# EAGLE design PHOTODIODE SENSOR (EAGLE 9.6.2)
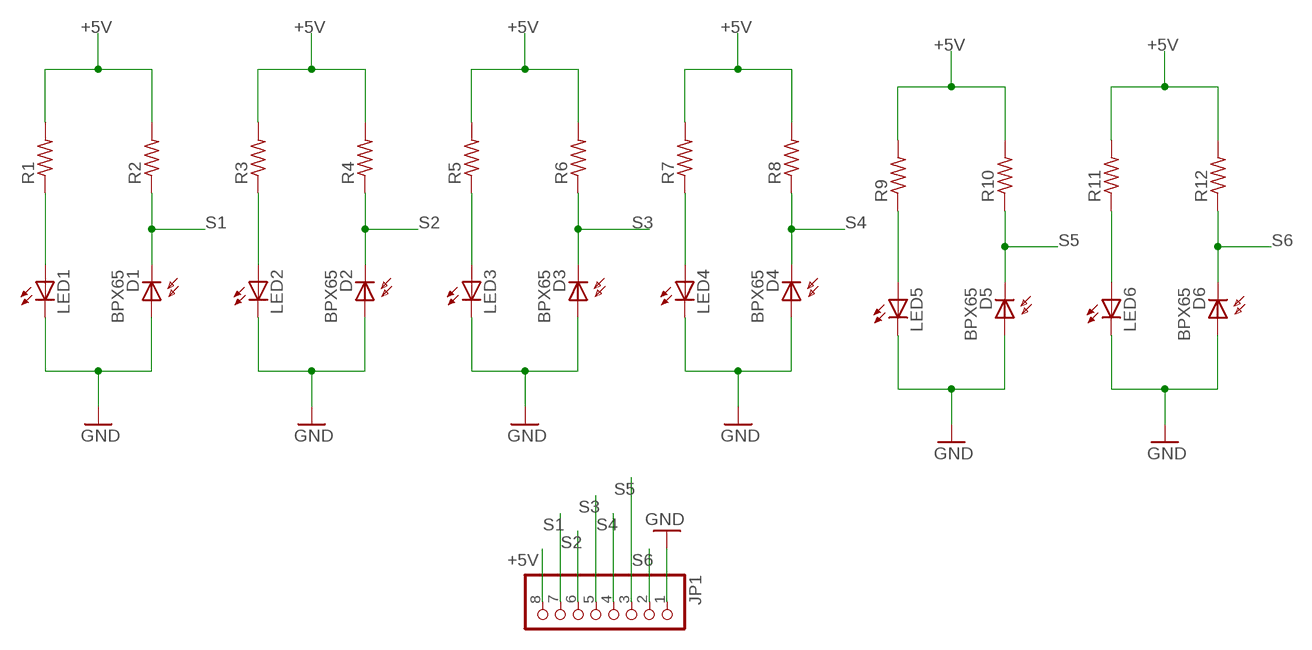
[diagram p0: schematic, sheet 1]

## Parts
D1  BPX65  [BPX65]
D2  BPX65  [BPX65]
D3  BPX65  [BPX65]
D4  BPX65  [BPX65]
D5  BPX65  [BPX65]
D6  BPX65  [BPX65]
JP1  PINHD-1X8  [1X08]
LED1  LED5MM  [LED5MM]
LED2  LED5MM  [LED5MM]
LED3  LED5MM  [LED5MM]
LED4  LED5MM  [LED5MM]
LED5  LED5MM  [LED5MM]
LED6  LED5MM  [LED5MM]
R1  R-US_0204/7  [0204/7]
R2  R-US_0204/7  [0204/7]
R3  R-US_0204/7  [0204/7]
R4  R-US_0204/7  [0204/7]
R5  R-US_0204/7  [0204/7]
R6  R-US_0204/7  [0204/7]
R7  R-US_0204/7  [0204/7]
R8  R-US_0204/7  [0204/7]
R9  R-US_0204/7  [0204/7]
R10  R-US_0204/7  [0204/7]
R11  R-US_0204/7  [0204/7]
R12  R-US_0204/7  [0204/7]

## Nets
+5V: JP1.8 R1.2 R2.2 R3.2 R4.2 R5.2 R6.2 R7.2 R8.2 R9.2 R10.2 R11.2 R12.2
GND: D1.A D2.A D3.A D4.A D5.A D6.A JP1.1 LED1.K(C) LED2.K(C) LED3.K(C) LED4.K(C) LED5.K(C) LED6.K(C)
N$1: LED2.A R3.1
N$2: LED3.A R5.1
N$3: LED1.A R1.1
N$4: LED4.A R7.1
N$5: LED5.A R9.1
N$6: LED6.A R11.1
S1: D1.K(C) JP1.7 R2.1
S2: D2.K(C) JP1.6 R4.1
S3: D3.K(C) JP1.5 R6.1
S4: D4.K(C) JP1.4 R8.1
S5: D5.K(C) JP1.3 R10.1
S6: D6.K(C) JP1.2 R12.1

## Library data of the parts
D1-D6 = opto-trans-siemens:BPX65: PHOTO DIODE; MPN: BPX65.; OC_FARNELL: 327451; OC_NEWARK: 06WX2764
JP1 = pinhead:PINHD-1X8: PIN HEADER
LED1-LED6 = led:LED: LED OSRAM: - CHIPLED LG R971, LG N971, LY N971, LG Q971, LY Q971, LO R971, LY R971 LH N974, LH R974 LS Q976, LO Q976, LY Q976 LO Q996 - Hyper CHIPLED LW Q18S LB Q993, LB Q99A, LB R99A - SideLED LS A670, LO A670, LY A670, LG A670, LP A670 LB A673, LV A673, LT A673, LW A673 LH A674 LY A675 LS A676, LA A676, LO A676, LY A676, LW A676 LS A679, LY A679, LG A679 - Hyper Micro SIDELED® LS Y876, LA Y876, LO Y876, LY Y876 LT Y87S - SmartLED LW L88C, LW L88S LB L89C, LB L89S, LG L890 LS L89K, LO L89K, LY L89K LS L896, LA L896, LO L896, LY L896 - TOPLED LS T670, LO T670, LY T670, LG T670, LP T670 LSG T670, LSP T670, LSY T670, LOP T670, LYG T670 LG T671, LOG T671, LSG T671 LB T673, LV T673, LT T673, LW T673 LH T674 LS T676, LA T676, LO T676, LY T676, LB T676, LH T676, LSB T676, LW T676 LB T67C, LV T67C, LT T67C, LS T67K, LO T67K, LY T67K, LW E67C LS E67B, LA E67B, LO E67B, LY E67B, LB E67C, LV E67C, LT E67C LW T67C LS T679, LY T679, LG T679 LS T770, LO T770, LY T770, LG T770, LP T770 LB T773, LV T773, LT T773, LW T773 LH T774 LS E675, LA E675, LY E675, LS T675 LS T776, LA T776, LO T776, LY T776, LB T776 LHGB T686 LT T68C, LB T68C - Hyper Mini TOPLED® LB M676 - Mini TOPLED Santana® LG M470 LS M47K, LO M47K, LY M47K Source: http://www.osram.convergy.de LUXEON: - LUMILED® LXK2-PW12-R00, LXK2-PW12-S00, LXK2-PW14-U00, LXK2-PW14-V00 LXK2-PM12-R00, LXK2-PM12-S00, LXK2-PM14-U00 LXK2-PE12-Q00, LXK2-PE12-R00, LXK2-PE12-S00, LXK2-PE14-T00, LXK2-PE14-U00 LXK2-PB12-K00, LXK2-PB12-L00, LXK2-PB12-M00, LXK2-PB14-N00, LXK2-PB14-P00, LXK2-PB14-Q00 LXK2-PR12-L00, LXK2-PR12-M00, LXK2-PR14-Q00, LXK2-PR14-R00 LXK2-PD12-Q00, LXK2-PD12-R00, LXK2-PD12-S00 LXK2-PH12-R00, LXK2-PH12-S00 LXK2-PL12-P00, LXK2-PL12-Q00, LXK2-PL12-R00 Source: www.luxeon.com KINGBRIGHT: KA-3528ASYC Source: www.kingbright.com
R1-R12 = rcl:R-US_: RESISTOR, American symbol; SPICEPREFIX: R

## Board
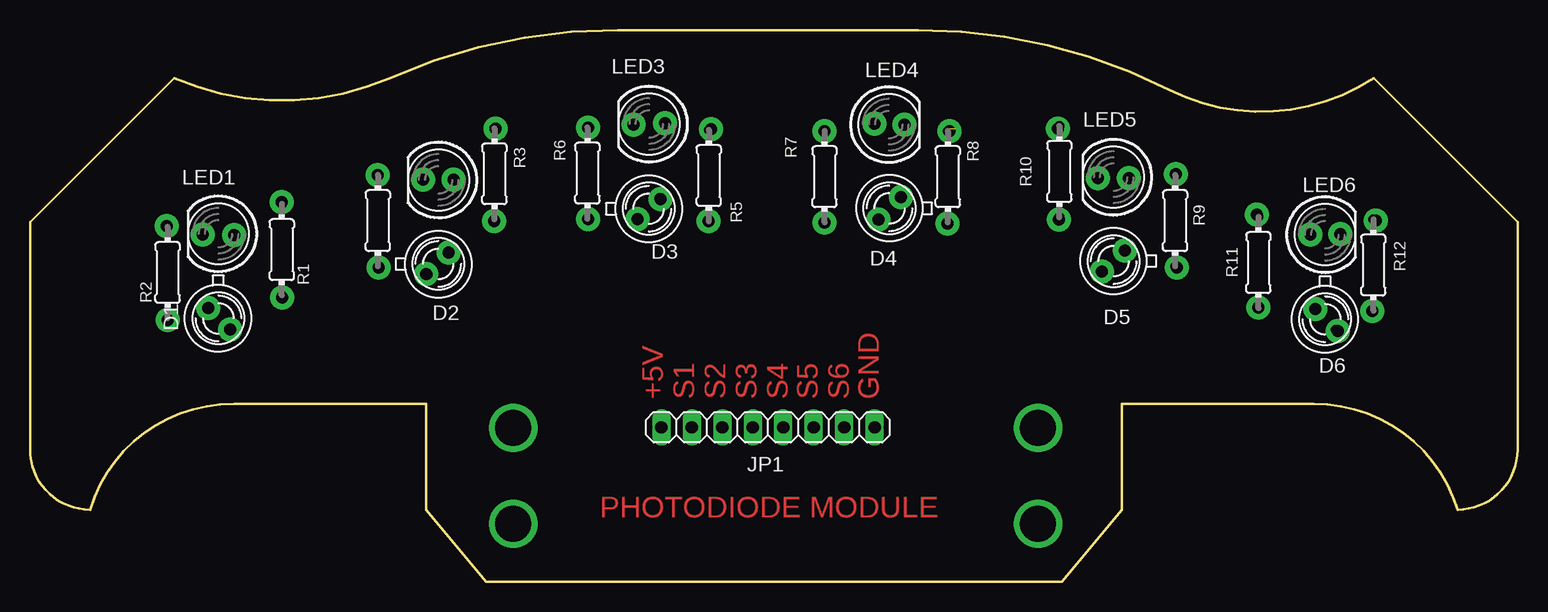
[diagram p1: board, top side]
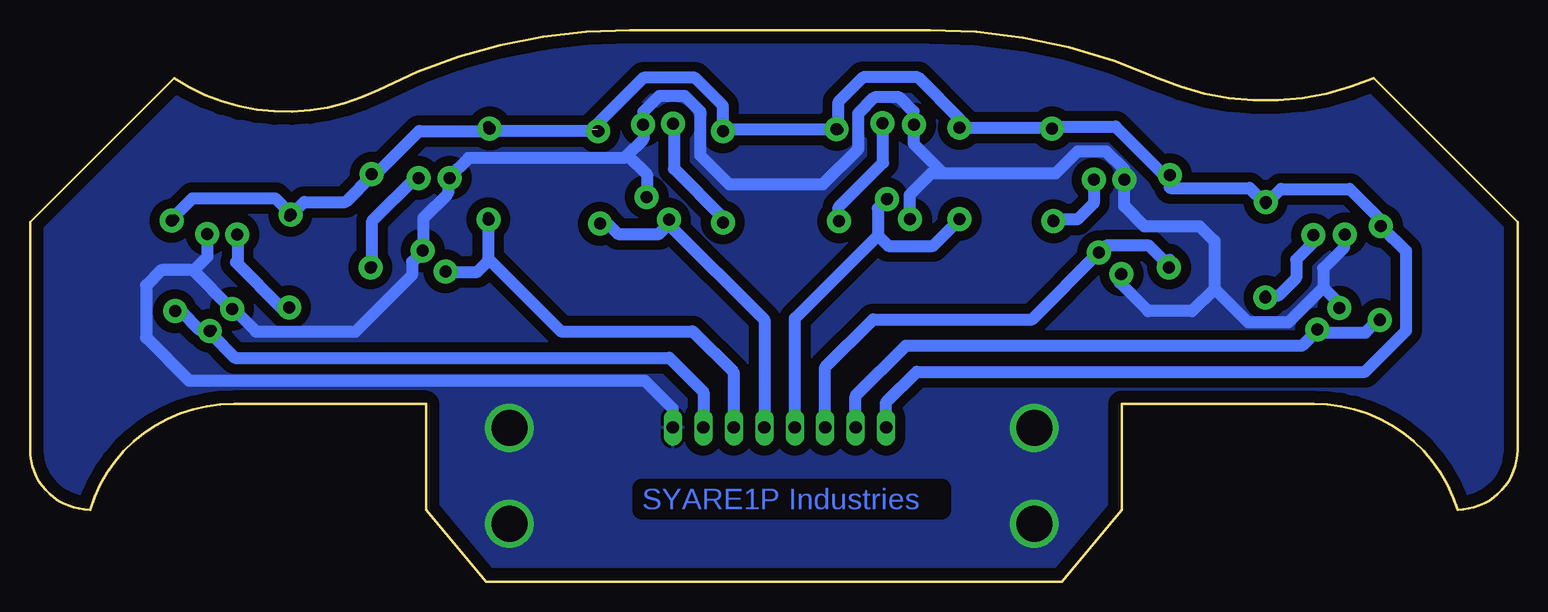
[diagram p2: board, bottom side, seen from below]

Size 124 x 46 mm. Coordinates in mm from the lower left corner, seen from the top.
Outline: 38,0 86,0 91,6 91,14.8 107,14.8 arc-74 119,6 arc90 124,11 124,30 112,42 arc-60 95,41 arc27 74,46 49,46 arc24 30,42 arc-48 12,42 0,30 0,11 arc90 5,6 arc-74 17,14.8 33,14.8 33,6 38,0
Copper layers (1*16): Top 0.035mm / dielectric 1.5mm / Bottom 0.035mm
Design rules "default": minimum track width 6mil, minimum drill 0.35mm, track to track 6mil, track to pad 6mil, pad to pad 6mil, via to via 6mil, smd to smd 6mil, copper to edge 40mil, drill to drill 6mil, minimum pad ring 10mil, minimum via ring 8mil, stop-mask expansion 4mil, vias tented up to drill 0mil, thermal gap 10mil

### Footprints (pad centres in the part's own frame; a part is rotated, then mirrored left to right if it is on the bottom)
BPX65 = drill 0.813 octagon: A -0.889,-0.889; K 0.889,0.889
1X08 = drill 1.016 long: 1 -8.89,0; 2 -6.35,0; 3 -3.81,0; 4 -1.27,0; 5 1.27,0; 6 3.81,0; 7 6.35,0; 8 8.89,0
LED5MM = drill 0.813 octagon: A -1.27,0; K 1.27,0
0204/7 = drill 0.813 octagon: 1 -3.81,0; 2 3.81,0

### Placement (x,y rotation side)
D1  15.7,21.95 270 top
D2  34.04,26.5 0 top
D3  51.57,31.1 0 top
D4  71.64,31.11 180 top
D5  90.32,26.71 180 top
D6  107.97,21.88 270 top
JP1  61.52,12.86 180 top
LED1  15.71,29 180 top
LED2  34.06,33.49 180 top
LED3  51.62,38.15 180 top
LED4  71.6,38.11 0 top
LED5  90.32,33.72 180 top
LED6  107.95,28.93 0 top
R1  20.99,27.67 90 top
R2  11.47,25.77 90 top
R3  38.72,34 90 top
R4  29,30.1 90 top
R5  56.59,33.86 90 top
R6  46.47,34.06 90 top
R7  66.23,33.76 90 top
R8  76.51,33.76 90 top
R9  95.46,30.1 90 top
R10  85.81,34.2 90 top
R11  102.4,26.6 90 top
R12  111.98,26.4 90 top

### Tracks (layer width: path | path; a pad name or v marks a point on that pad's centre or on a via)
+5V  (1 unrouted)
  Bottom 1.016: R10.2 85.55,37.74 | 77.14,37.74 72.87,42.02 68.58,42.02 66.23,39.67 R7.2 | R10.2 86.24,37.58 91.56,37.58 95.23,33.91 R9.2 97.7,31.66 101.14,31.66 R11.2 102.4,30.8 103.58,31.98 110.44,31.98 111.98,30.43 R12.2 | JP1.8 52.63,14.96 50.1,17.49 12.71,17.49 9.28,20.93 9.28,27.57 11.29,29.58 R2.2 11.47,30.22 14,32.75 19.72,32.75 R1.2 22.34,32.83 28.95,32.83 29,32.88 R4.2 29.47,33.91 33.5,37.95 38.59,37.95 R3.2 38.78,37.87 R6.2 46.47,38.52 49.99,42.05 54.55,42.05 56.59,40.02 R5.2 66.13,37.67 R7.2 | R7.2 65.83,37.57 | R7.2 66.23,37.77 | 76.41,37.67 R8.2 | R8.2 76.69,37.74 | R8.2 85.37,37.57 R10.2
GND  (via drill 1 pad 2, 3 pad 4)
  Bottom 1.016: JP1.1 70.41,14.41 72.74,16.74 110.73,16.74 114.33,20.34 114.33,24.7 113.07,25.96 110.45,25.96 | D1.A 14.66,22.99 16.2,24.52 | LED1.K 14.44,27.86 16.2,26.11 16.2,24.52 | 16.2,24.52 19.1,21.61 22.45,21.61 25.27,24.44 | 25.27,24.44 25.27,28.4 26.48,29.61 31.11,29.61 32.79,31.3 LED2.K v32.79,33.52 32.79,34.36 34.31,35.88 36.67,35.88 38.52,34.03 47.84,34.03 | D2.A 33.15,24.92 30.79,22.55 27.13,22.55 25.27,24.41 25.27,24.44 | 47.84,34.03 48.89,34.03 50.68,32.24 D3.A | 47.84,34.03 50.34,36.53 LED3.K 50.34,39.21 51.53,40.39 53.59,40.39 54.95,39.02 54.95,36.1 57.92,33.14 65.72,33.14 68.14,35.55 68.14,39.22 69.43,40.51 71.54,40.51 72.87,39.18 LED4.K 72.87,36.91 74.22,35.56 | 74.22,35.56 74.47,35.31 87.46,35.31 LED5.K 89.15,33.62 89.15,32.36 91.21,30.3 D5.A 92.15,26.66 92.15,25.55 96.86,20.84 105.15,20.84 D6.A 107.26,22.77 110.45,25.96 | 74.22,35.56 72.53,33.88 D4.A | 109.22,28.46 LED6.K 109.22,27.07 110.33,25.96 110.45,25.96
  other vias: 40.29,12.81 84.04,12.81 40.29,4.81 84.04,4.81
  pour Bottom (isolate 0.813): -3,-2 126,-2 126,52 -3,52
N$1
  Bottom 1.016: LED2.A 35.33,31.56 36.7,30.19 R3.1
N$2  (via drill 1 pad 2)
  Bottom 1.016: v56.55,30.05 R5.1 56.59,31.23 52.88,34.92 LED3.A
N$3
  Bottom 1.016: LED1.A 16.98,28.32 18.45,26.85 18.45,25.32 19.91,23.86 R1.1
N$4
  Bottom 1.016: R7.1 66.23,30.33 70.33,34.43 LED4.A
N$5
  Bottom 1.016: 95.41,26.24 R9.1 95.46,30.09 91.83,33.72 LED5.A
N$6
  Bottom 1.016: 106.48,29.13 LED6.A 106.68,26.76 106.83,26.61 103.01,22.79 R11.1
N$7  (via drill 1 pad 2)
  other vias: 11.48,21.81
N$8  (via drill 1 pad 2)
  other vias: 14.84,22.82
N$9  (via drill 1 pad 2)
  other vias: 16.7,21.02
N$10  (via drill 1 pad 2)
  other vias: 14.38,28.95
N$11  (via drill 1 pad 2)
  other vias: 11.38,29.66
N$12  (via drill 1 pad 2)
  other vias: 17.03,28.89
N$13  (via drill 1 pad 2)
  other vias: 21.02,23.7
N$14  (via drill 1 pad 2)
  other vias: 20.98,31.66
N$15  (via drill 1 pad 2)
  other vias: 29.05,26.19
N$16  (via drill 1 pad 2)
  other vias: 33.02,25.64
N$17  (via drill 1 pad 2)
  other vias: 34.88,27.44
N$18  (via drill 1 pad 2)
  other vias: 35.32,33.52
N$19  (via drill 1 pad 2)
  other vias: 28.97,33.89
N$20  (via drill 1 pad 2)
  other vias: 38.68,30.06
N$21  (via drill 1 pad 2)
  other vias: 50.64,30.22
N$22  (via drill 1 pad 2)
  other vias: 52.58,31.88
N$23  (via drill 1 pad 2)
  other vias: 38.81,37.77
N$24  (via drill 1 pad 2)
  other vias: 50.3,38.09
N$25  (via drill 1 pad 2)
  other vias: 52.92,38.21
N$26  (via drill 1 pad 2)
  other vias: 46.51,30.25
N$27  (via drill 1 pad 2)
  other vias: 56.76,37.75
N$28  (via drill 1 pad 2)
  other vias: 46.51,37.85
N$29  (via drill 1 pad 2)
  other vias: 76.64,37.55
N$30  (via drill 1 pad 2)
  other vias: 76.49,29.85
N$31  (via drill 1 pad 2)
  other vias: 66.24,37.55
N$32  (via drill 1 pad 2)
  other vias: 66.24,29.95
N$33  (via drill 1 pad 2)
  other vias: 70.39,38.17
N$34  (via drill 1 pad 2)
  other vias: 72.91,38.1
N$35  (via drill 1 pad 2)
  other vias: 70.74,30.18
N$36  (via drill 1 pad 2)
  other vias: 72.59,32.08
N$37  (via drill 1 pad 2)
  other vias: 85.68,37.79
N$38  (via drill 1 pad 2)
  other vias: 91.61,33.66
N$39  (via drill 1 pad 2)
  other vias: 95.51,33.99
N$40  (via drill 1 pad 2)
  other vias: 85.78,30.19
N$41  (via drill 1 pad 2)
  other vias: 89.01,33.66
N$42  (via drill 1 pad 2)
  other vias: 89.36,25.87
N$43  (via drill 1 pad 2)
  other vias: 91.26,27.62
N$44  (via drill 1 pad 2)
  other vias: 95.61,26.19
N$45  (via drill 1 pad 2)
  other vias: 102.41,22.87
N$46  (via drill 1 pad 2)
  other vias: 109.01,20.9
N$47  (via drill 1 pad 2)
  other vias: 107.15,22.73
N$48  (via drill 1 pad 2)
  other vias: 111.91,22.55
N$49  (via drill 1 pad 2)
  other vias: 102.29,30.59
N$50  (via drill 1 pad 2)
  other vias: 106.71,28.95
N$51  (via drill 1 pad 2)
  other vias: 109.21,28.99
N$52  (via drill 1 pad 2)
  other vias: 112.19,30.09
S1
  Bottom 1.016: JP1.7 55.17,15.48 50.99,19.66 17.99,19.66 D1.K 16.29,20.76 12.67,20.76 R2.1
S2
  Bottom 1.016: 29,26.84 R4.1 30.72,28.01 34.3,28.01 D2.K 40.44,21.87 53.72,21.87 57.71,17.88 JP1.6
S3
  Bottom 1.016: R6.1 46.27,30.05 | D3.K 53.33,31.12 53.33,28.87 | JP1.5 60.25,21.95 53.33,28.87 | R6.1 46.59,30.12 | 53.33,28.87 52.46,28 48.72,28 R6.1
S4
  Bottom 1.016: 70.45,30.07 70.6,30.07 D4.K 70.75,29.8 | 70.75,29.8 62.79,21.84 JP1.4 | R8.1 75.95,29.95 75,29 71.55,29 70.75,29.8
S5
  Bottom 1.016: 86.17,30.4 R10.1 85.81,26.94 | JP1.3 65.33,17.42 68.78,20.87 79.74,20.87 85.81,26.94 | D5.K 86.73,25.82 85.81,26.74 85.81,26.94
S6
  Bottom 1.016: JP1.2 67.87,15.83 70.69,18.65 106.92,18.65 108.86,20.59 D6.K 109.88,20.99 111.48,22.59 R12.1

### Text on the board
Top: +5V | S1 | S2 | S3 | S4 | S5 | S6 | GND | PHOTODIODE MODULE
Bottom: SYARE1P Industries